# Altium schematic sheet STM32_IO.SchDoc
size A4; SheetNumber: 1; SheetTotal: 3
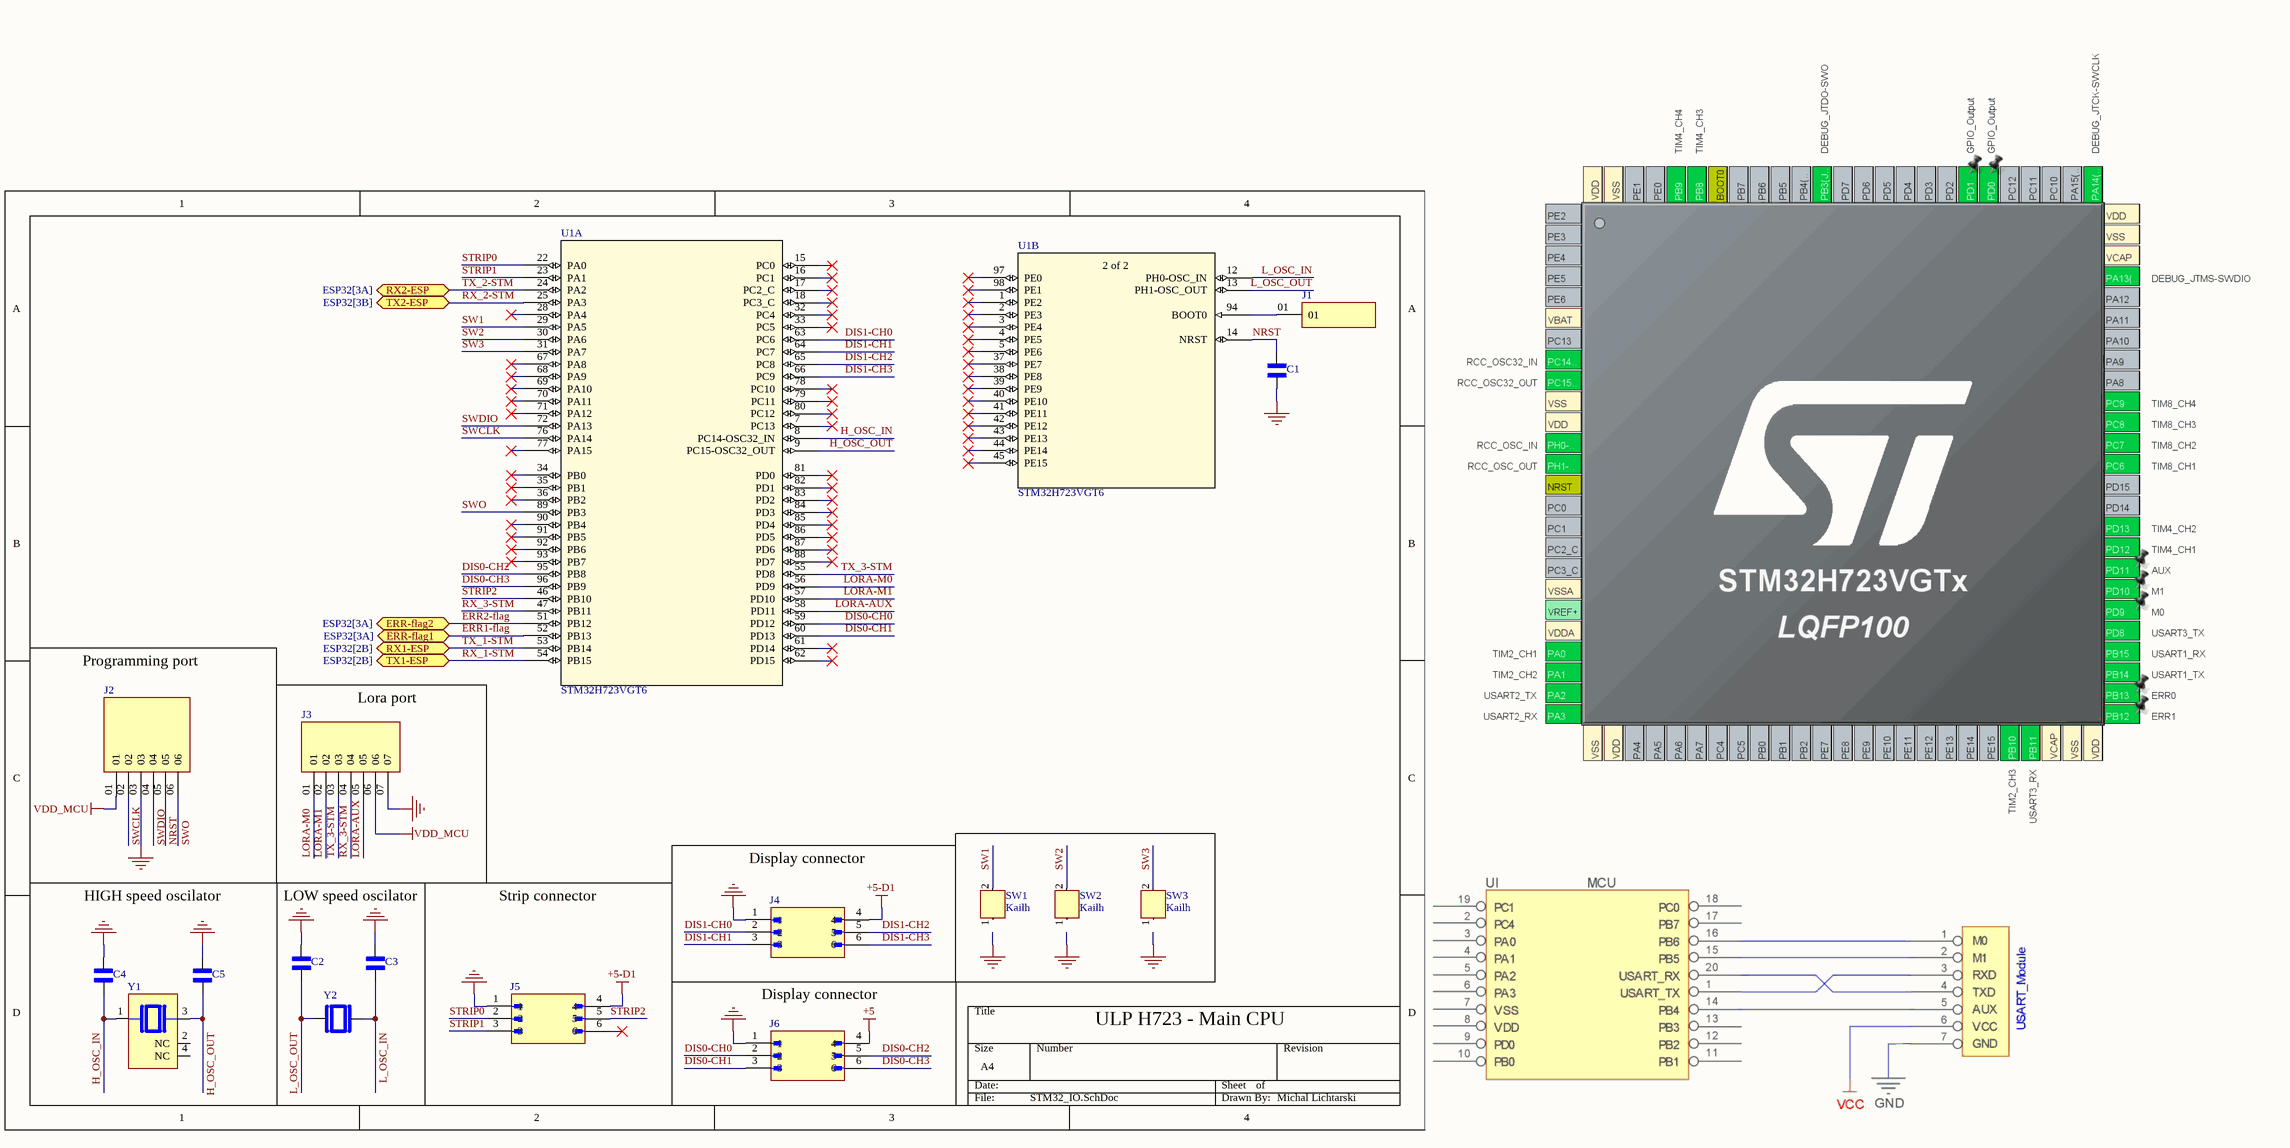
[diagram p0: STM32_IO.SchDoc]

## Parts
C1  CL10C180JB8NNNC  [CAPC1608X90N]  (value not drawn)
C2  CL10C180JB8NNNC  [CAPC1608X90N]  (value not drawn)
C3  CL10C180JB8NNNC  [CAPC1608X90N]  (value not drawn)
C4  CL10C100JB8NNNC  [CAPC1608X90N]  (value not drawn)
C5  CL10C100JB8NNNC  [CAPC1608X90N]  (value not drawn)
J1  TSW-101-07-G-S  [SAMTEC_TSW-101-07-G-S]  (value not drawn)
J2  TSW-106-07-G-S  [SAMTEC_TSW-106-07-G-S]  (value not drawn)
J3  TSW-107-07-G-S  [SAMTEC_TSW-107-07-G-S]  (value not drawn)
J4  874270602  [MOLEX_874270602]  (value not drawn)
J5  874270602  [MOLEX_874270602]  (value not drawn)
J6  874270602  [MOLEX_874270602]  (value not drawn)
SW1  Kailh  [SW_MX_reversible]
SW2  Kailh  [SW_MX_reversible]
SW3  Kailh  [SW_MX_reversible]
U1  STM32H723VGT6  [LQFP100_STM]  (parts A,B of 3)
Y1  QT325G-25.000MEEV-T  [XTAL_QT325G-25.000MEEV-T]  (value not drawn)
Y2  ABS07-32.768KHZ-T  [XTAL_ABS07-32.768KHZ-T]  (value not drawn)

## Ports
ERR-flag1 (bidir, see ESP32[3A]), ERR-flag2 (bidir, see ESP32[3A]), RX1-ESP (bidir, see ESP32[2B]), RX2-ESP (bidir, see ESP32[3A]), TX1-ESP (bidir, see ESP32[2B]), TX2-ESP (bidir, see ESP32[3B])

## Nets
+5: J6.4
+5-D1: J4.4 J5.4
GND: C1.2 C2.1 C3.1 C4.1 C5.1 J2.03 J3.07 J4.1 J5.1 J6.1
VDD_MCU: J2.01 J3.06
DIS0-CH0: J6.2 U1.59(PD12)
DIS0-CH1: J6.3 U1.60(PD13)
DIS0-CH2: J6.5 U1.95(PB8)
DIS0-CH3: J6.6 U1.96(PB9)
DIS1-CH0: J4.2 U1.63(PC6)
DIS1-CH1: J4.3 U1.64(PC7)
DIS1-CH2: J4.5 U1.65(PC8)
DIS1-CH3: J4.6 U1.66(PC9)
ERR1-flag: U1.52(PB13) ; port ERR-flag1
ERR2-flag: U1.51(PB12) ; port ERR-flag2
H_OSC_IN: C4.2 U1.8(PC14-OSC32_IN) Y1.1
H_OSC_OUT: C5.2 U1.9(PC15-OSC32_OUT) Y1.3
L_OSC_IN: C3.2 U1.12(PH0-OSC_IN) Y2.2
L_OSC_OUT: C2.2 U1.13(PH1-OSC_OUT) Y2.1
LORA-AUX: J3.05 U1.58(PD11)
LORA-M0: J3.01 U1.56(PD9)
LORA-M1: J3.02 U1.57(PD10)
NRST: C1.1 J2.05 U1.14(NRST)
RX_1-STM: U1.54(PB15) ; port TX1-ESP
RX_2-STM: U1.25(PA3) ; port TX2-ESP
RX_3-STM: J3.04 U1.47(PB11)
STRIP0: J5.2 U1.22(PA0)
STRIP1: J5.3 U1.23(PA1)
STRIP2: J5.5 U1.46(PB10)
SW1: SW1.2 U1.29(PA5)
SW2: SW2.2 U1.30(PA6)
SW3: SW3.2 U1.31(PA7)
SWCLK: J2.02 U1.76(PA14)
SWDIO: J2.04 U1.72(PA13)
SWO: J2.06 U1.89(PB3)
TX_1-STM: U1.53(PB14) ; port RX1-ESP
TX_2-STM: U1.24(PA2) ; port RX2-ESP
TX_3-STM: J3.03 U1.55(PD8)
NetJ1_01: J1.01 U1.94(BOOT0)

Not connected (* = marked no-connect by the designer): J5 6*; SW1 1; SW2 1; SW3 1; U1 1(PE2)* 2(PE3)* 3(PE4)* 4(PE5)* 5(PE6)* 7(PC13)* 15(PC0)* 16(PC1)* 17(PC2_C)* 18(PC3_C)* 28(PA4)* 32(PC4)* 33(PC5)* 34(PB0)* 35(PB1)* 36(PB2)* 37(PE7)* 38(PE8)* 39(PE9)* 40(PE10)* 41(PE11)* 42(PE12)* 43(PE13)* 44(PE14)* 45(PE15)* 61(PD14)* 62(PD15)* 67(PA8)* 68(PA9)* 69(PA10)* 70(PA11)* 71(PA12)* 77(PA15)* 78(PC10)* 79(PC11)* 80(PC12)* 81(PD0)* 82(PD1)* 83(PD2)* 84(PD3)* 85(PD4)* 86(PD5)* 87(PD6)* 88(PD7)* 90(PB4)* 91(PB5)* 92(PB6)* 93(PB7)* 97(PE0)* 98(PE1)*; Y1 2(NC) 4(NC)

## Notes on the sheet
- Programming port
- Lora port
- HIGH speed oscilator
- LOW speed oscilator
- Strip connector
- Display connector
- ULP H723 - Main CPU
- Michal Lichtarski
- (in symbol STM32H723VGT6, part B) 2 of 2

## Library data of the parts
C1 = CL10A105KA8NNNC: 100nF 0603; MF: {'manufacturer': u'Samsung Electro-Mechanics'}; Package: None; Price: None; Value: *; MP: CL10A105KA8NNNC; Availability: Unavailable
C2-C5 = CL10A105KA8NNNC: 18pf 0603; MF: {'manufacturer': u'Samsung Electro-Mechanics'}; Package: None; Price: None; Value: *; MP: CL10A105KA8NNNC; Availability: Unavailable
J1 = TSW-101-07-G-S: MF: {'manufacturer': u'Samtec Inc.'}; Package: None; Price: None; Value: *; MP: TSW-101-07-G-S; Availability: Unavailable
J2 = TSW-106-07-G-S: MF: {'manufacturer': u'Samtec Inc.'}; Package: None; Price: None; Value: *; MP: TSW-106-07-G-S; Availability: Unavailable
J3 = TSW-107-07-G-S: <a href="https://pricing.snapeda.com/parts/TSW-107-07-G-S/Samtec%20Inc./view-part?ref=eda">Check availability</a>; MF: {'manufacturer': u'Samtec Inc.'}; Package: None; Price: None; Value: *; MP: TSW-107-07-G-S; Availability: Unavailable
SW1-SW3 = Component_1: Kailh mechanical switch
U1 = STM32H723VGT6: No Description Available; Mfr_Name: STMicroelectronics; Copyright: Copyright (C) 2023 Ultra Librarian. All rights reserved.; Manufacturer_Part_Number: STM32H723VGT6; RefDes: RefDes; Type: DEV
Y1 = QT325G-25.000MEEV-T: 25 MHz Â±10ppm Crystal 8pF 60 Ohms 4-SMD, No Lead; MF: QST PRODUCTS LLC; SnapEDA_Link: https://www.snapeda.com/parts/QT325G-25.000MEEV-T/QST+PRODUCTS+LLC/view-part/?ref=snap; Package: NON STANDARD-4 QST PRODUCTS LLC; Value: *; MP: QT325G-25.000MEEV-T; Check_prices: https://www.snapeda.com/parts/QT325G-25.000MEEV-T/QST+PRODUCTS+LLC/view-part/?ref=eda
Y2 = ABS07-32.768KHZ-T: <a href="https://pricing.snapeda.com/parts/ABS07-32.768KHZ-T/Abracon%20LLC/view-part?ref=eda">Check availability</a> <a href="https://pricing.snapeda.com/parts/ABS07-32.768KHZ-T/Abracon%20LLC/view-part?ref=eda">Check availability</a>; MF: {'manufacturer': u'SHENZHEN YANGXING TECHNOLOGY CO., LTD.'}; Package: None; Price: None; Value: *; MP: ABS07-32.768KHZ-T; Availability: Unavailable
J4-J6 = 874270602: Price: None; Availability: Unavailable; MP: 874270602; Value: *; Package: None